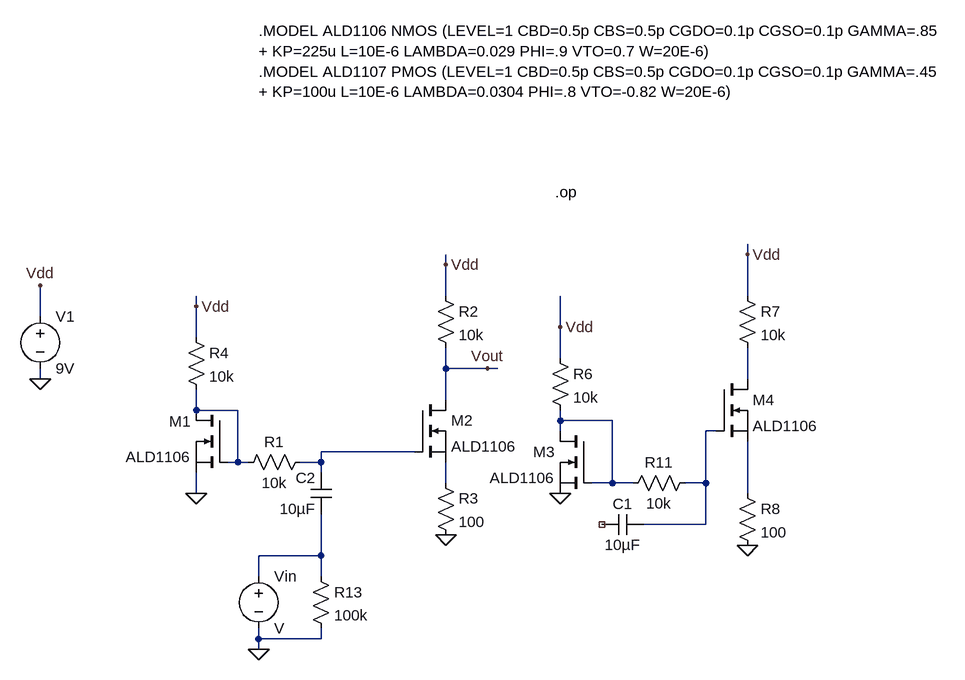
[diagram p0: schematic Design1.asc]
Design1.asc, the LTspice schematic file:
Version 4
SHEET 1 1188 992
WIRE 688 368 688 352
WIRE 224 384 224 368
WIRE 224 432 224 384
WIRE 688 432 688 368
WIRE -160 448 -160 432
WIRE -400 464 -400 416
WIRE 400 480 400 432
WIRE -160 496 -160 448
WIRE 400 528 400 480
WIRE 224 544 224 512
WIRE 288 544 224 544
WIRE 304 544 288 544
WIRE -400 560 -400 544
WIRE 688 560 688 512
WIRE 224 592 224 544
WIRE -160 608 -160 576
WIRE -96 608 -160 608
WIRE 400 624 400 608
WIRE 480 624 400 624
WIRE 400 640 400 624
WIRE 640 640 624 640
WIRE 176 672 32 672
WIRE -96 688 -96 608
WIRE -96 688 -112 688
WIRE -80 688 -96 688
WIRE 32 688 32 672
WIRE 32 688 0 688
WIRE 32 704 32 688
WIRE 224 720 224 688
WIRE 480 720 480 624
WIRE 480 720 448 720
WIRE 512 720 480 720
WIRE 624 720 624 640
WIRE 624 720 592 720
WIRE -160 736 -160 704
WIRE 688 736 688 656
WIRE 624 784 624 720
WIRE 624 784 528 784
WIRE 32 832 32 768
WIRE 32 832 -64 832
WIRE -64 864 -64 832
WIRE 32 864 32 832
WIRE -64 960 -64 944
WIRE 32 960 32 944
WIRE 32 960 -64 960
WIRE -64 976 -64 960
FLAG -160 736 0
FLAG -400 560 0
FLAG 224 800 0
FLAG -400 416 Vdd
FLAG -160 448 Vdd
FLAG 400 736 0
FLAG 400 480 Vdd
FLAG 688 816 0
FLAG 688 368 Vdd
FLAG 224 384 Vdd
FLAG 288 544 Vout
FLAG -64 976 0
SYMBOL nmos -112 608 M0
WINDOW 0 56 17 Left 2
SYMATTR InstName M1
SYMATTR Value ALD1106
SYMBOL nmos 176 592 R0
SYMATTR InstName M2
SYMATTR Value ALD1106
SYMBOL nmos 448 640 M0
SYMATTR InstName M3
SYMATTR Value ALD1106
SYMBOL nmos 640 560 R0
SYMATTR InstName M4
SYMATTR Value ALD1106
SYMBOL cap 48 768 R180
WINDOW 0 24 56 Left 2
WINDOW 3 24 8 Left 2
SYMATTR InstName C2
SYMATTR Value 10µF
SYMBOL res 16 672 R90
WINDOW 0 0 56 VBottom 2
WINDOW 3 32 56 VTop 2
SYMATTR InstName R1
SYMATTR Value 10k
SYMBOL voltage -400 448 R0
SYMATTR InstName V1
SYMATTR Value 9V
SYMBOL voltage -64 848 R0
SYMATTR InstName Vin
SYMBOL res 208 704 R0
SYMATTR InstName R3
SYMATTR Value 100
SYMBOL res -176 480 R0
SYMATTR InstName R4
SYMATTR Value 10k
SYMBOL res 208 416 R0
SYMATTR InstName R2
SYMATTR Value 10k
SYMBOL res 384 512 R0
SYMATTR InstName R6
SYMATTR Value 10k
SYMBOL res 672 416 R0
SYMATTR InstName R7
SYMATTR Value 10k
SYMBOL res 672 720 R0
SYMATTR InstName R8
SYMATTR Value 100
SYMBOL res 608 704 R90
WINDOW 0 0 56 VBottom 2
WINDOW 3 32 56 VTop 2
SYMATTR InstName R11
SYMATTR Value 10k
SYMBOL cap 528 768 R90
WINDOW 0 0 32 VBottom 2
WINDOW 3 32 32 VTop 2
SYMATTR InstName C1
SYMATTR Value 10µF
SYMBOL res 16 848 R0
SYMATTR InstName R13
SYMATTR Value 100k
TEXT -64 24 Left 2 !.MODEL ALD1106 NMOS (LEVEL=1 CBD=0.5p CBS=0.5p CGDO=0.1p CGSO=0.1p GAMMA=.85\n+ KP=225u L=10E-6 LAMBDA=0.029 PHI=.9 VTO=0.7 W=20E-6)\n.MODEL ALD1107 PMOS (LEVEL=1 CBD=0.5p CBS=0.5p CGDO=0.1p CGSO=0.1p GAMMA=.45\n+ KP=100u L=10E-6 LAMBDA=0.0304 PHI=.8 VTO=-0.82 W=20E-6)
TEXT 392 272 Left 2 !.op

The netlist it stands for:
* Design1.asc
M1 N002 N002 0 0 ALD1106
M2 Vout N005 N006 N006 ALD1106
M3 N003 N003 0 0 ALD1106
M4 N001 N004 N007 N007 ALD1106
C2 N008 N005 10µF
R1 N005 N002 10k
V1 Vdd 0 9V
Vin N008 0 V
R3 N006 0 100
R4 Vdd N002 10k
R2 Vdd Vout 10k
R6 Vdd N003 10k
R7 Vdd N001 10k
R8 N007 0 100
R11 N004 N003 10k
C1 N004 NC_01 10µF
R13 N008 0 100k
.model NMOS NMOS
.model PMOS PMOS
.lib standard.mos
.MODEL ALD1106 NMOS (LEVEL=1 CBD=0.5p CBS=0.5p CGDO=0.1p CGSO=0.1p GAMMA=.85
+ KP=225u L=10E-6 LAMBDA=0.029 PHI=.9 VTO=0.7 W=20E-6)
.MODEL ALD1107 PMOS (LEVEL=1 CBD=0.5p CBS=0.5p CGDO=0.1p CGSO=0.1p GAMMA=.45
+ KP=100u L=10E-6 LAMBDA=0.0304 PHI=.8 VTO=-0.82 W=20E-6)
.op
.backanno
.end